# Altium schematic sheet Main.SchDoc
size 635 x 279 mm
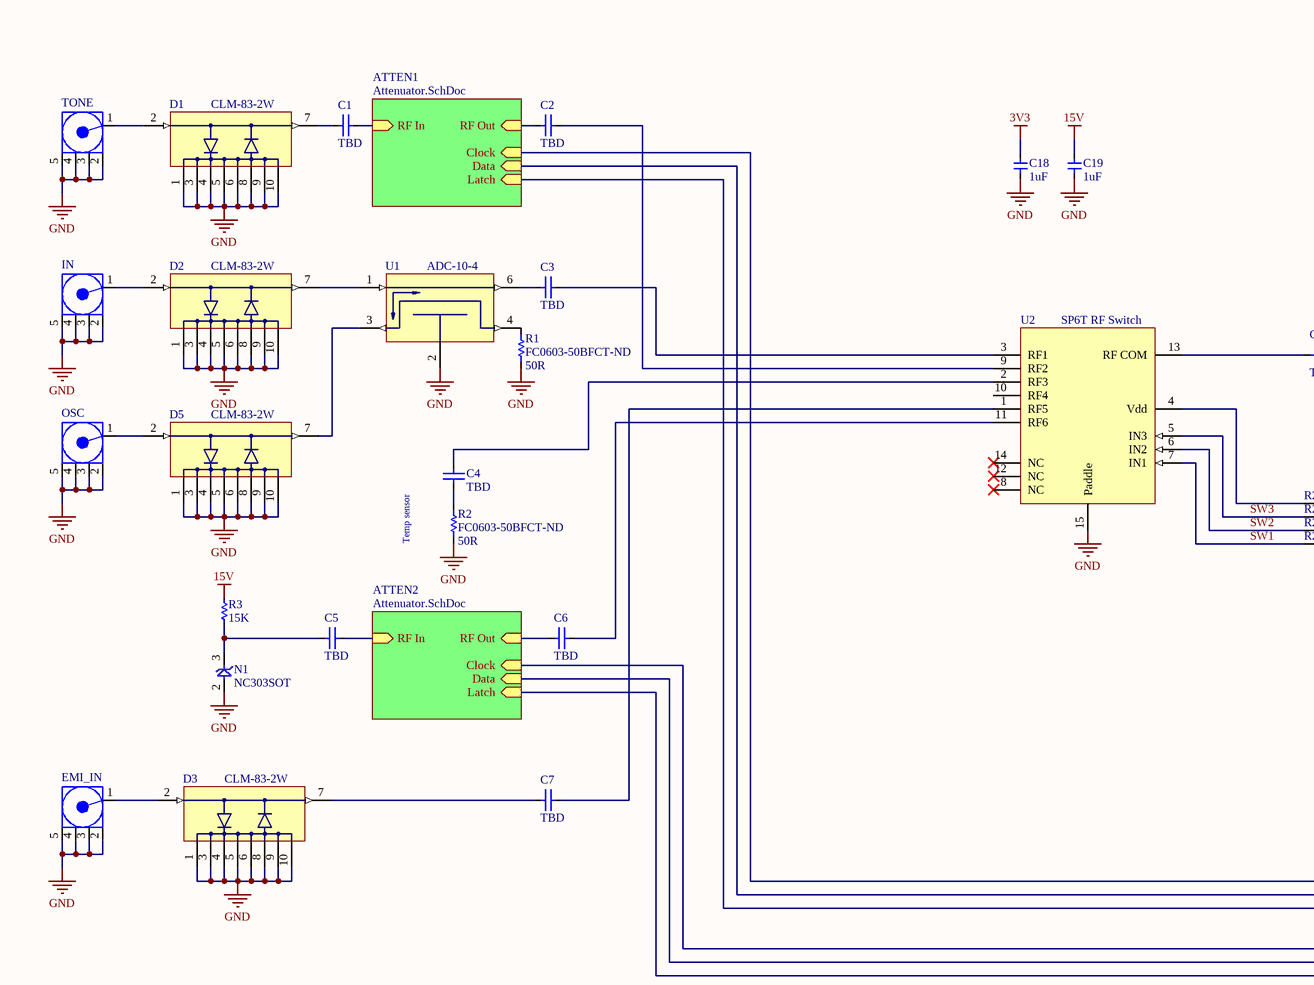
[diagram p0: Main.SchDoc, left]
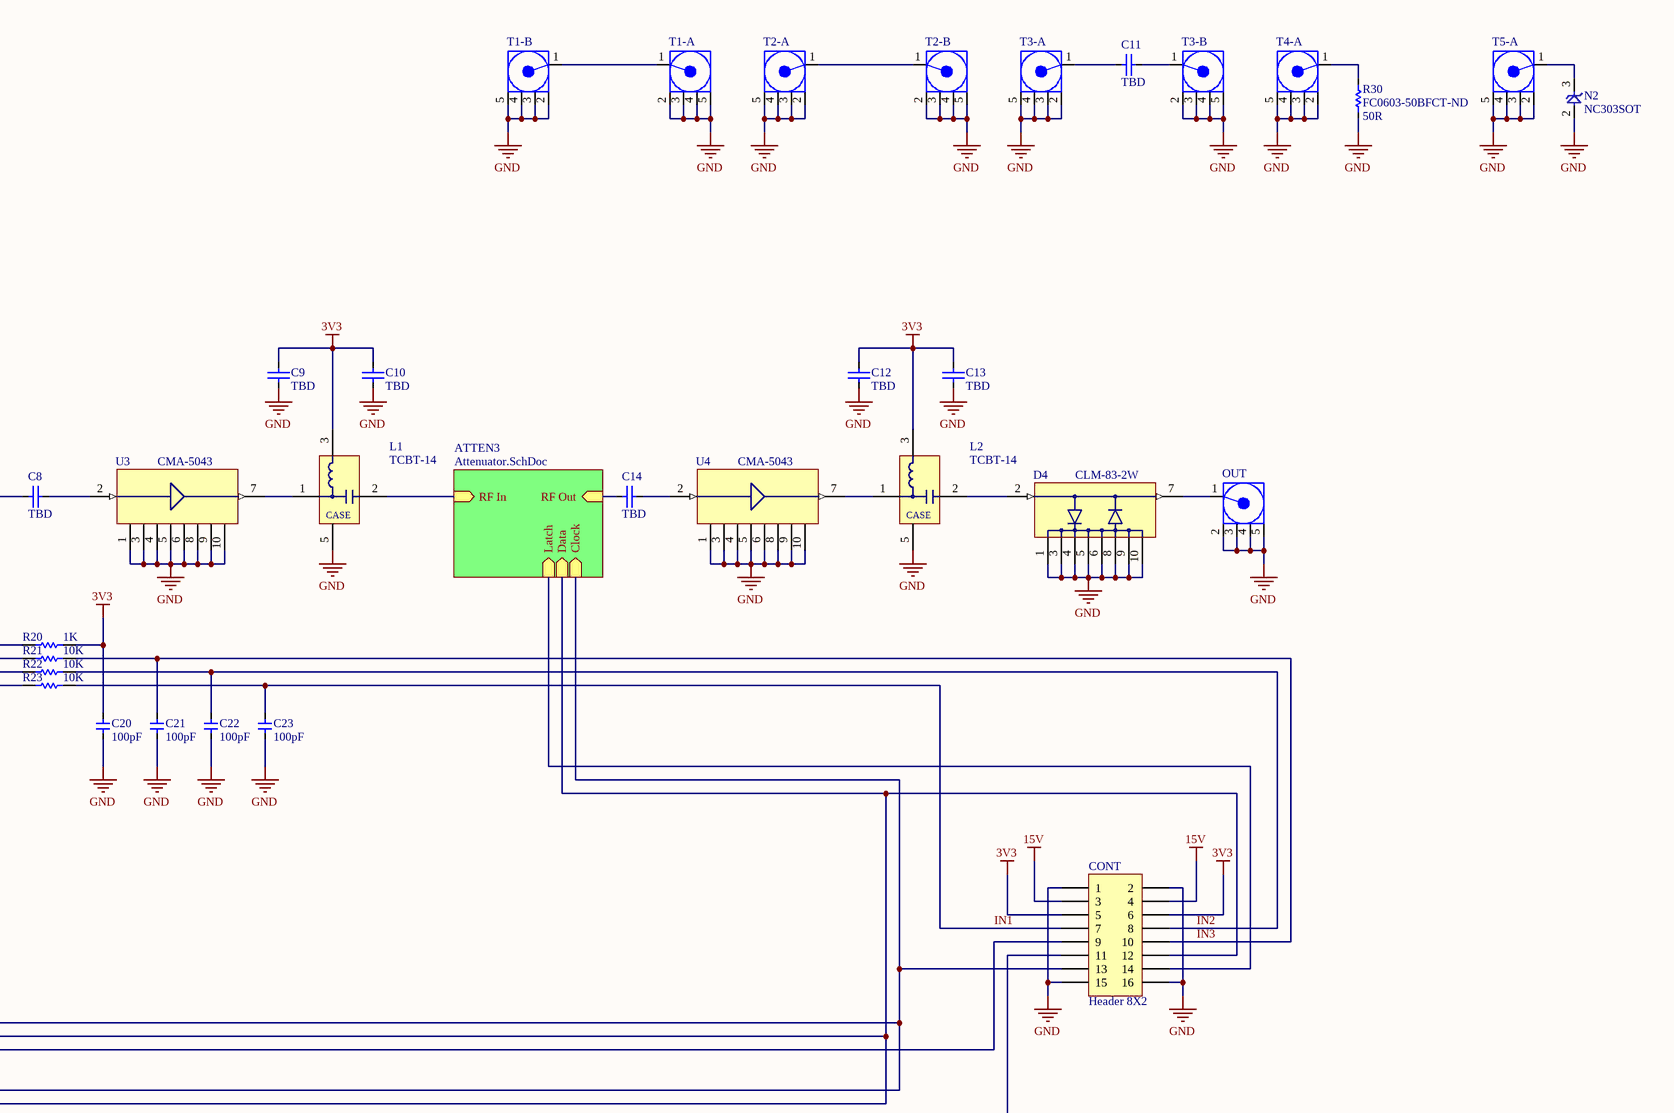
[diagram p1: Main.SchDoc, right]

## Parts
C1  value TBD  [0402C]  (hidden comment: Cap)
C2  value TBD  [0402C]  (hidden comment: Cap)
C3  value TBD  [0402C]  (hidden comment: Cap)
C4  value TBD  [0402C]  (hidden comment: Cap)
C5  value TBD  [0402C]  (hidden comment: Cap)
C6  value TBD  [0402C]  (hidden comment: Cap)
C7  value TBD  [0402C]  (hidden comment: Cap)
C8  value TBD  [0402C]  (hidden comment: Cap)
C9  value TBD  [0805C]  (hidden comment: Cap)
C10  value TBD  [0805C]  (hidden comment: Cap)
C11  value TBD  [0402C]  (hidden comment: Cap)
C12  value TBD  [0805C]  (hidden comment: Cap)
C13  value TBD  [0805C]  (hidden comment: Cap)
C14  value TBD  [0402C]  (hidden comment: Cap)
C18  value 1uF  [V]  (hidden comment: SMT Cap)
C19  value 1uF  [V]  (hidden comment: SMT Cap)
C20  value 100pF  [0603C]  (hidden comment: SMT Cap)
C21  value 100pF  [0603C]  (hidden comment: SMT Cap)
C22  value 100pF  [0603C]  (hidden comment: SMT Cap)
C23  value 100pF  [0603C]  (hidden comment: SMT Cap)
CONT  Header 8X2  [SMT 16-pin rectangular header]
D1  CLM-83-2W  [DL1721]
D2  CLM-83-2W  [DL1721]
D3  CLM-83-2W  [DL1721]
D4  CLM-83-2W  [DL1721]
D5  CLM-83-2W  [DL1721]
EMI_IN  COAX-M  [SMT RA SMA Connector]  (value not drawn)
IN  COAX-M  [SMT RA SMA Connector]  (value not drawn)
L1  TCBT-14  [GU1414]
L2  TCBT-14  [GU1414]
N1  NC303SOT  [SOT323-3AN]
N2  NC303SOT  [SOT323-3AN]
OSC  COAX-M  [SMT RA SMA Connector]  (value not drawn)
OUT  COAX-M  [SMT RA SMA Connector]  (value not drawn)
R1  FC0603-50BFCT-ND  value 50R  [0603R]
R2  FC0603-50BFCT-ND  value 50R  [0603R]
R3  value 15K  [1206R]  (hidden comment: Res Semi Small)
R20  value 1K  [0603R]  (hidden comment: RES Semi)
R21  value 10K  [0603R]  (hidden comment: RES Semi)
R22  value 10K  [0603R]  (hidden comment: RES Semi)
R23  value 10K  [0603R]  (hidden comment: RES Semi)
R30  FC0603-50BFCT-ND  value 50R  [0603R]
T1-A  COAX-M  [SMT RA SMA Connector]  (value not drawn)
T1-B  COAX-M  [SMT RA SMA Connector]  (value not drawn)
T2-A  COAX-M  [SMT RA SMA Connector]  (value not drawn)
T2-B  COAX-M  [SMT RA SMA Connector]  (value not drawn)
T3-A  COAX-M  [SMT RA SMA Connector]  (value not drawn)
T3-B  COAX-M  [SMT RA SMA Connector]  (value not drawn)
T4-A  COAX-M  [SMT RA SMA Connector]  (value not drawn)
T5-A  COAX-M  [SMT RA SMA Connector]  (value not drawn)
TONE  COAX-M  [SMT RA SMA Connector]  (value not drawn)
U1  ADC-10-4  [CD542]
U2  SP6T RF Switch  [MT1817]
U3  CMA-5043  [DL1721]
U4  CMA-5043  [DL1721]

## Sub-sheets
ATTEN1 = Attenuator.SchDoc: RF In (in), RF Out (in), Clock (in), Data (in), Latch (in)
ATTEN2 = Attenuator.SchDoc: RF In (in), RF Out (in), Clock (in), Data (in), Latch (in)
ATTEN3 = Attenuator.SchDoc: RF In (in), RF Out (in), Clock (in), Data (in), Latch (in)

## Nets
3V3: C9.2 C10.2 C12.2 C13.2 C18.1 C20.2 CONT.5 CONT.6 L1.3(DC) L2.3(DC) R20.2
15V: C19.1 CONT.3 CONT.4 R3.2
GND: C9.1 C10.1 C12.1 C13.1 C18.2 C19.2 C20.1 C21.1 C22.1 C23.1 CONT.1 CONT.2 CONT.15 CONT.16 D1.1(Gnd) D1.3(Gnd) D1.4(Gnd) D1.5(Gnd) D1.6(Gnd) D1.8(Gnd) D1.9(Gnd) D1.10(Gnd) D2.1(Gnd) D2.3(Gnd) D2.4(Gnd) D2.5(Gnd) D2.6(Gnd) D2.8(Gnd) D2.9(Gnd) D2.10(Gnd) D3.1(Gnd) D3.3(Gnd) D3.4(Gnd) D3.5(Gnd) D3.6(Gnd) D3.8(Gnd) D3.9(Gnd) D3.10(Gnd) D4.1(Gnd) D4.3(Gnd) D4.4(Gnd) D4.5(Gnd) D4.6(Gnd) D4.8(Gnd) D4.9(Gnd) D4.10(Gnd) D5.1(Gnd) D5.3(Gnd) D5.4(Gnd) D5.5(Gnd) D5.6(Gnd) D5.8(Gnd) D5.9(Gnd) D5.10(Gnd) EMI_IN.2(GND) EMI_IN.3(GND) EMI_IN.4(GND) EMI_IN.5(GND) IN.2(GND) IN.3(GND) IN.4(GND) IN.5(GND) L1.5(CASE) L2.5(CASE) N1.2(A) N2.2(A) OSC.2(GND) OSC.3(GND) OSC.4(GND) OSC.5(GND) OUT.2(GND) OUT.3(GND) OUT.4(GND) OUT.5(GND) R1.1 R2.1 R30.1 T1-A.2(GND) T1-A.3(GND) T1-A.4(GND) T1-A.5(GND) T1-B.2(GND) T1-B.3(GND) T1-B.4(GND) T1-B.5(GND) T2-A.2(GND) T2-A.3(GND) T2-A.4(GND) T2-A.5(GND) T2-B.2(GND) T2-B.3(GND) T2-B.4(GND) T2-B.5(GND) T3-A.2(GND) T3-A.3(GND) T3-A.4(GND) T3-A.5(GND) T3-B.2(GND) T3-B.3(GND) T3-B.4(GND) T3-B.5(GND) T4-A.2(GND) T4-A.3(GND) T4-A.4(GND) T4-A.5(GND) T5-A.2(GND) T5-A.3(GND) T5-A.4(GND) T5-A.5(GND) TONE.2(GND) TONE.3(GND) TONE.4(GND) TONE.5(GND) U1.2(Gnd) U2.15(Paddle) U3.1(Gnd) U3.3(Gnd) U3.4(Gnd) U3.5(Gnd) U3.6(Gnd) U3.8(Gnd) U3.9(Gnd) U3.10(Gnd) U4.1(Gnd) U4.3(Gnd) U4.4(Gnd) U4.5(Gnd) U4.6(Gnd) U4.8(Gnd) U4.9(Gnd) U4.10(Gnd)
IN1: C23.2 CONT.7 R23.2
IN2: C22.2 CONT.8 R22.2
IN3: C21.2 CONT.10 R21.2
SW1: R23.1 U2.7(IN1)
SW2: R22.1 U2.6(IN2)
SW3: R21.1 U2.5(IN3)
NetC1_1: C1.1 D1.7(Gnd)
NetC1_2: C1.2 ; sheet ATTEN1/RF In
NetC2_1: C2.1 ; sheet ATTEN1/RF Out
NetC2_2: C2.2 U2.9(RF2)
NetC3_1: C3.1 U1.6(Output)
NetC3_2: C3.2 U2.3(RF1)
NetC4_1: C4.1 R2.2
NetC4_2: C4.2 U2.2(RF3)
NetC5_1: C5.1 N1.3(C) R3.1
NetC5_2: C5.2 ; sheet ATTEN2/RF In
NetC6_1: C6.1 ; sheet ATTEN2/RF Out
NetC6_2: C6.2 U2.11(RF6)
NetC7_1: C7.1 D3.7(Gnd)
NetC7_2: C7.2 U2.1(RF5)
NetC8_1: C8.1 U2.13(RF_COM)
NetC8_2: C8.2 U3.2(In)
NetC11_1: C11.1 T3-A.1(Signal)
NetC11_2: C11.2 T3-B.1(Signal)
NetC14_1: C14.1 ; sheet ATTEN3/RF Out
NetC14_2: C14.2 U4.2(In)
NetCONT_9: CONT.9 ; sheet ATTEN1/Latch
NetCONT_11: CONT.11 ; sheet ATTEN2/Latch
NetCONT_12: CONT.12 ; sheet ATTEN1/Data, sheet ATTEN2/Data, sheet ATTEN3/Data
NetCONT_13: CONT.13 ; sheet ATTEN1/Clock, sheet ATTEN2/Clock, sheet ATTEN3/Clock
NetCONT_14: CONT.14 ; sheet ATTEN3/Latch
NetD1_2: D1.2(In) TONE.1(Signal)
NetD2_2: D2.2(In) IN.1(Signal)
NetD2_7: D2.7(Gnd) U1.1(Input)
NetD3_2: D3.2(In) EMI_IN.1(Signal)
NetD4_2: D4.2(In) L2.2(RF)
NetD4_7: D4.7(Gnd) OUT.1(Signal)
NetD5_2: D5.2(In) OSC.1(Signal)
NetD5_7: D5.7(Gnd) U1.3(Coupled)
NetL1_1: L1.1(RF+DC) U3.7(Gnd)
NetL1_2: L1.2(RF) ; sheet ATTEN3/RF In
NetL2_1: L2.1(RF+DC) U4.7(Gnd)
NetN2_3: N2.3(C) T5-A.1(Signal)
NetR1_2: R1.2 U1.4(Termination)
NetR20_1: R20.1 U2.4(Vdd)
NetR30_2: R30.2 T4-A.1(Signal)
NetT1-A_1: T1-A.1(Signal) T1-B.1(Signal)
NetT2-A_1: T2-A.1(Signal) T2-B.1(Signal)

Not connected (* = marked no-connect by the designer): L1 4(NC); L2 4(NC); U1 5(DNC); U2 8(NC)* 10(RF4) 12(NC)* 14(NC)*

## Notes on the sheet
- Temp sensor
- Title
- Size:
- Date:
- Tabloid
- Number:
- Time:
- Revision:
- Sheet
- of
- File:

## Library data of the parts
C1-C14 = Cap: Capacitor; Published: 8-Jun-2000; LatestRevisionDate: 17-Jul-2002; LatestRevisionNote: Re-released for DXP Platform.; PackageReference: RAD-0.3; Publisher: Altium Limited
C18-C23 = Cap - SMT Small: Published: 8-Jun-2000; LatestRevisionDate: 29-May-2009; LatestRevisionNote: IPC-7351 Footprint Added.; PackageReference: C1206; Publisher: Altium Limited; PackageDescription: Chip Capacitor
CONT = Header 8X2: Header, 8-Pin, Dual row; LatestRevisionDate: 17-Jul-2002; LatestRevisionNote: Re-released for DXP Platform.; Publisher: Altium Limited
D1-D5 = CLM-83-2W: +12 to +32 dBm RF Limiter
EMI_IN IN OSC OUT T1-A T1-B T2-A T2-B T3-A T3-B T4-A T5-A TONE = COAX-M: RF Coaxial PCB Connector, MMCX; Thru-Hole, Vertical Mount Plug,  50 Ohm Impedance; PackageDocument: Rev. A, 16-Jun-1997; PCB_Layout: Complies with manufacturer's recommendation.; DrillSize: Corresponds to nominal value.; Published: 15-Jul-2004; LatestRevisionDate: 15-Jul-2004; LatestRevisionNote: Component Replaced.; DatasheetDocument: 30-May-2003; PackageReference: 908-21103; Publisher: Altium Limited; ComponentLink1Description: Manufacturer Link; ComponentLink1URL: http://www.amphenolrf.com/
L1 L2 = TCBT-14: Surface Mount 10 MHz to 10 GHz Bias Tee
N1 N2 = NC303SOT: SMT Noise Diode
R1 R2 R30 = RES Semi: Published: 8-Jun-2000; LatestRevisionDate: 17-Jul-2002; LatestRevisionNote: Re-released for DXP Platform.; PackageReference: AXIAL-0.5; Publisher: Altium Limited
R3 = Res Semi Small: Semiconductor Resistor; Published: 8-Jun-2000; LatestRevisionDate: 17-Jul-2002; LatestRevisionNote: Re-released for DXP Platform.; PackageReference: AXIAL-0.5; Publisher: Altium Limited
R20-R23 = RES Semi: Semiconductor Resistor; Published: 8-Jun-2000; LatestRevisionDate: 17-Jul-2002; LatestRevisionNote: Re-released for DXP Platform.; PackageReference: AXIAL-0.5; Publisher: Altium Limited
U1 = ADC-10-4: Surface Mount Directional Coupler
U2 = JSW6-33DR+: SP6T RF Switch 50Ω 10 to 2700 MHz
U3 U4 = CMA-5043: Low Noise, High IP3 Monolithic Amplifier